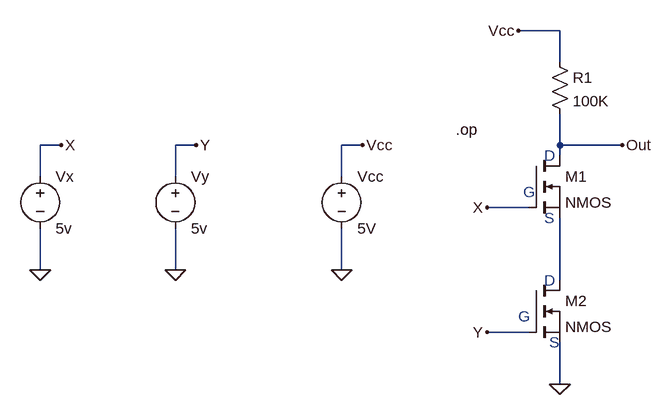
[diagram p0: schematic Draft1.asc]
Draft1.asc, the LTspice schematic file:
Version 4
SHEET 1 880 680
WIRE 384 -112 320 -112
WIRE 384 -64 384 -112
WIRE -384 64 -416 64
WIRE -176 64 -208 64
WIRE 80 64 48 64
WIRE 384 64 384 16
WIRE 480 64 384 64
WIRE 384 80 384 64
WIRE -416 112 -416 64
WIRE -208 112 -208 64
WIRE 48 112 48 64
WIRE 336 160 272 160
WIRE -416 256 -416 192
WIRE -208 256 -208 192
WIRE 48 256 48 192
WIRE 384 272 384 176
WIRE 336 352 272 352
WIRE 384 432 384 368
FLAG 48 256 0
FLAG 80 64 Vcc
FLAG 384 432 0
FLAG 320 -112 Vcc
FLAG 272 160 X
FLAG 272 352 Y
FLAG 480 64 Out
FLAG -416 256 0
FLAG -208 256 0
FLAG -384 64 X
FLAG -176 64 Y
SYMBOL voltage 48 96 R0
SYMATTR InstName Vcc
SYMATTR Value 5V
SYMBOL nmos 336 80 R0
SYMATTR InstName M1
SYMBOL nmos 336 272 R0
SYMATTR InstName M2
SYMBOL res 368 -80 R0
SYMATTR InstName R1
SYMATTR Value 100K
SYMBOL voltage -416 96 R0
SYMATTR InstName Vx
SYMATTR Value 5v
SYMBOL voltage -208 96 R0
SYMATTR InstName Vy
SYMATTR Value 5v
TEXT 360 80 Left 2 ;D
TEXT 328 136 Left 2 ;G
TEXT 360 176 Left 2 ;S
TEXT 360 272 Left 2 ;D
TEXT 320 328 Left 2 ;G
TEXT 368 368 Left 2 ;S
TEXT 224 40 Left 2 !.op

The netlist it stands for:
* Draft1.asc
Vcc Vcc 0 5V
M1 Out X N001 N001 NMOS
M2 N001 Y 0 0 NMOS
R1 Vcc Out 100K
Vx X 0 5v
Vy Y 0 5v
.model NMOS NMOS
.model PMOS PMOS
.lib standard.mos
* D
* G
* S
* D
* G
* S
.op
.backanno
.end